# Altium project L298N_Motor_Driver.PrjPcb
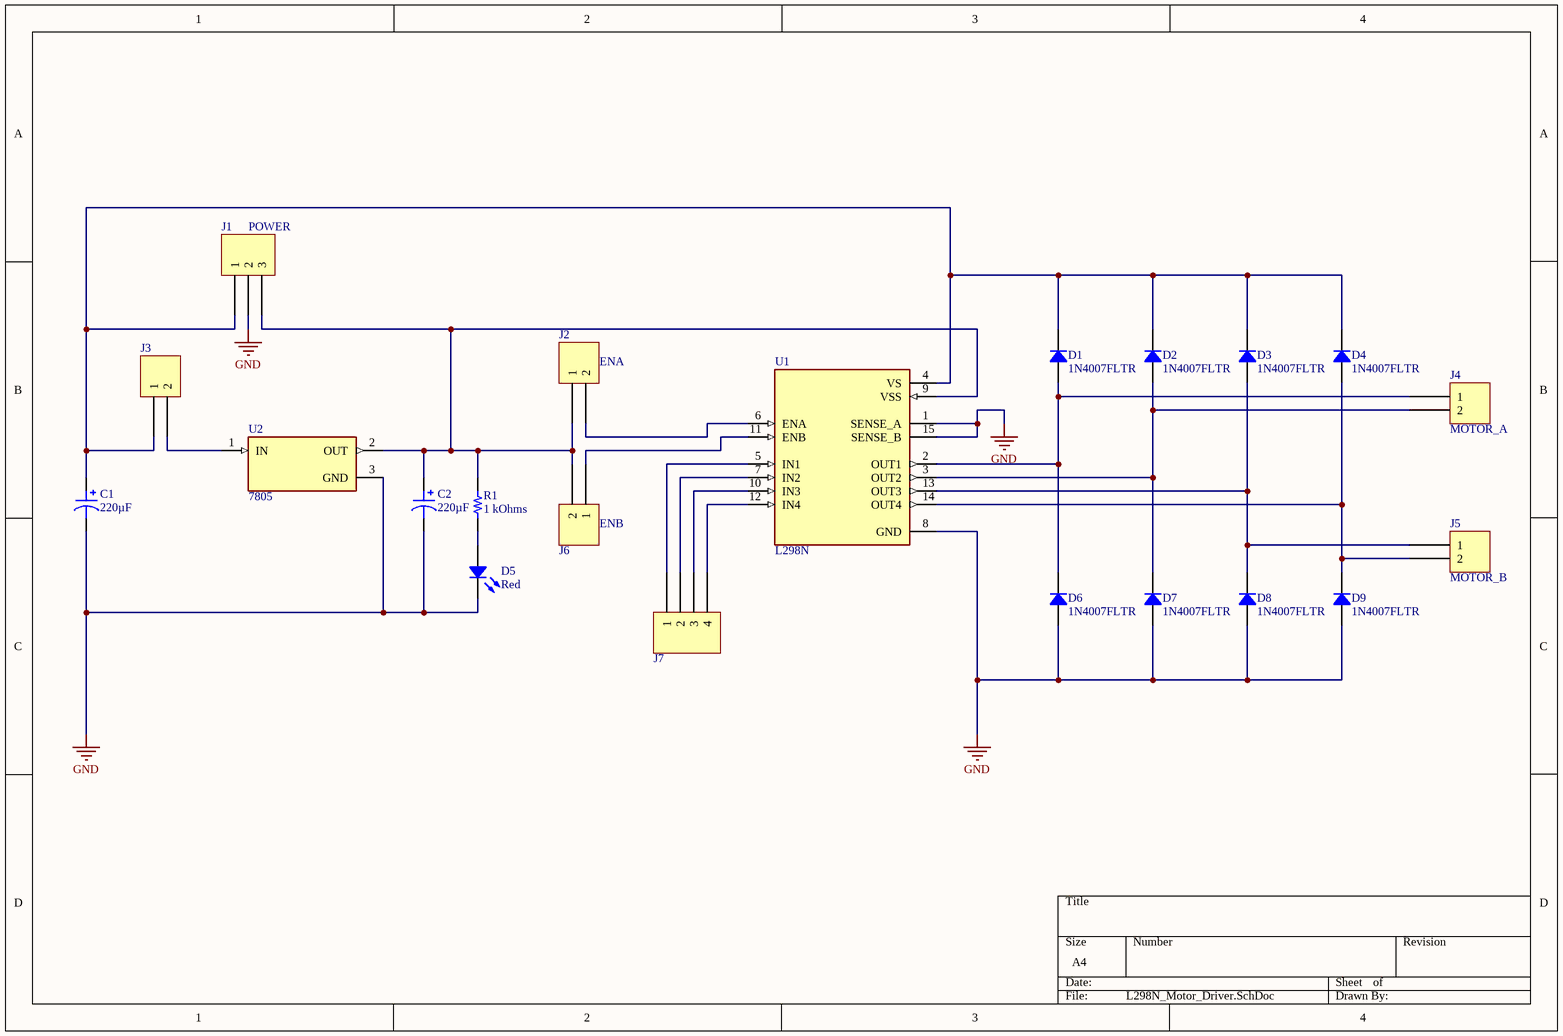
[diagram p0: L298N_Motor_Driver.SchDoc]
1 sheet, 21 parts. Net scope: global (net labels, ports and power ports of the same name join across sheets).
Board file: L298N_Motor_Driver.PcbDoc

## Sheet L298N_Motor_Driver.SchDoc
size A4; SheetNumber: 1; SheetTotal: 1

### Parts
C1  220µF  [CAP ALSMD 8.3MM H10.5MM]
C2  220µF  [CAP ALSMD 8.3MM H10.5MM]
D1  1N4007FLTR  [SOD123F]
D2  1N4007FLTR  [SOD123F]
D3  1N4007FLTR  [SOD123F]
D4  1N4007FLTR  [SOD123F]
D5  Red  [LED 0805_2012 RED]
D6  1N4007FLTR  [SOD123F]
D7  1N4007FLTR  [SOD123F]
D8  1N4007FLTR  [SOD123F]
D9  1N4007FLTR  [SOD123F]
J1  POWER  [TE 282834-3]
J2  ENA  [Header 2 PIN]
J3  Header 2 PIN  [Header 2 PIN]  (value not drawn)
J4  MOTOR_A  [TE 282834-2]
J5  MOTOR_B  [TE 282834-2]
J6  ENB  [Header 2 PIN]
J7  Header 4 PIN  [Header 4 PIN]  (value not drawn)
R1  1 kOhms  [RES 0805_2012]
U1  L298N  [L298N]
U2  7805  [7805CD2T]

### Nets
GND: C1.2 C2.2 D5.2 D6.1 D7.1 D8.1 D9.1 J1.2 U1.1(SENSE_A) U1.8(GND) U1.15(SENSE_B) U2.3(GND)
NetC1_1: C1.1 D1.2 D2.2 D3.2 D4.2 J1.1 J3.1 U1.4(VS)
NetC2_1: C2.1 J1.3 J2.1 J6.2 R1.2 U1.9(VSS) U2.2(OUT)
NetD1_1: D1.1 D6.2 J4.1 U1.2(OUT1)
NetD2_1: D2.1 D7.2 J4.2 U1.3(OUT2)
NetD3_1: D3.1 D8.2 J5.1 U1.13(OUT3)
NetD4_1: D4.1 D9.2 J5.2 U1.14(OUT4)
NetD5_1: D5.1 R1.1
NetJ2_2: J2.2 U1.6(ENA)
NetJ3_2: J3.2 U2.1(IN)
NetJ6_1: J6.1 U1.11(ENB)
NetJ7_1: J7.1 U1.5(IN1)
NetJ7_2: J7.2 U1.7(IN2)
NetJ7_3: J7.3 U1.10(IN3)
NetJ7_4: J7.4 U1.12(IN4)

### Library data of the parts
C1 C2 = UUR1V221MNL6GS: CAP ALUM 220UF 20% 35V SMD; manufacturer: Nichicon; Lifetime @ Temp.: 2000 Hrs @ 85°C; Ripple Current @ High Frequency: 319.8mA @ 10kHz; Ripple Current @ Low Frequency: 246mA @ 120Hz; Surface Mount Land Size: 0.327" L x 0.327" W (8.30mm x 8.30mm); Part Number: UUR1V221MNL6GS; Applications: General Purpose; Capacitance: 220µF; componentlink1description: Datasheet; componentlink1url: http://nichicon-us.com/english/products/pdfs/e-uur.pdf; componentlink2description: DigiKey Link; componentlink2url: http://digikey.com/product-detail/en/nichicon/UUR1V221MNL6GS/493-6238-1-ND/3438751; Device Package: Radial, Can - SMD; Height - Seated (Max): 0.413" (10.50mm); lastupdated: 2.09.2020 01:25:15; Lifecycle Status: Active; Minimum Order: 1; Mounting Type: Surface Mount; Operating Temperature: -40°C ~ 85°C; Package / Case: Radial, Can - SMD; packaging: TapeAndReel; partid: 7568; Part Status: Active; price: 0.20; series: UUR; Size / Dimension: 0.315" Dia (8.00mm); Supplier 1: DigiKey; Supplier Part Number 1: 493-6238-1-ND; Tolerance: ±20%; value: 220µF; Voltage - Rated: 35V
D1-D4 D6-D9 = 1N4007FLTR: STANDARD RECTIFIER 1000V SOD-123; Manufacturer: SMC Diode Solutions; Capacitance @ Vr, F: 15pF @ 4V, 1MHz; Current - Average Rectified (Io): 1A; Current - Reverse Leakage @ Vr: 5µA @ 1000V; Speed: Standard Recovery >500ns, > 200mA (Io); Voltage - Forward (Vf) (Max) @ If: 1.1V @ 1A; Part Number: 1N4007FLTR; ComponentLink1Description: Datasheet; ComponentLink1URL: http://www.smc-diodes.com/propdf/1N4001FL-1N4007FL%20N1646%20REV.A.pdf; ComponentLink2Description: DigiKey Link; ComponentLink2URL: http://digikey.com/product-detail/en/smc-diode-solutions/1N4007FLTR/1655-1N4007FLCT-ND/11657827; Diode Type: Standard; LastUpdated: 30.08.2020 20:59:55; Lifecycle Status: Active; Minimum Order: 1; Mounting Type: Surface Mount; Package / Case: SOD-123F; Packaging: TapeAndReel; PartId: 3314; Price: 0.01; Supplier 1: DigiKey; Supplier Part Number 1: 1655-1N4007FLCT-ND; Supplier Device Package: SOD-123FL; Voltage - DC Reverse (Vr) (Max): 1000V
D5 = XZMDK54W-4: LED RED CLEAR 0805 SMD; Manufacturer: SunLED; Current - Test: 20mA; Lens Color: Colorless; Lens Size: 1.30mm x 1.25mm; Lens Style: Rectangle with Flat Top; Millicandela Rating: 228mcd; Viewing Angle: 140°; Voltage - Forward (Vf) (Typ): 1.95V; Wavelength - Dominant: 630nm; Wavelength - Peak: 645nm; Part Number: XZMDK54W-4; Color: Red; ComponentLink1Description: Datasheet; ComponentLink1URL: https://www.sunledusa.com/products/spec/XZMDK54W-4.pdf; ComponentLink2Description: DigiKey Link; ComponentLink2URL: https://www.digikey.com/en/products/detail/sunled/XZMDK54W-4/13559300; Device Package: 0805 (2012 Metric); Height (Max): 0.50mm; LastUpdated: 3.06.2024 20:00:05; Lens Transparency: Clear; Lifecycle Status: Active; Minimum Order: 1; Mounting Type: Surface Mount; Package / Case: 0805 (2012 Metric); Packaging: TapeAndReel; PartId: 1067; Part Status: Active; Price: 0.05; Series: -; Size / Dimension: 2.00mm L x 1.25mm W; Supplier 1: DigiKey; Supplier Part Number 1: 1497-XZMDK54W-4CT-ND; Supplier Device Package: 0805; Value: Red
J1 = 282834-3: TERM BLK 3P SIDE ENT 2.54MM PCB; Manufacturer: TE Connectivity AMP Connectors; Current: 10A; Mating Orientation: Horizontal with Board; Number of Levels: 1; Pitch: 0.100" (2.54mm); Positions Per Level: 3; Voltage: 150V; Wire Gauge: 16-30 AWG; Wire Termination: Screw - Rising Cage Clamp; Part Number: 282834-3; Color: Green; ComponentLink1Description: Datasheet; ComponentLink1URL: https://www.te.com/commerce/DocumentDelivery/DDEController?Action=srchrtrv&DocNm=282834&DocType=Customer+Drawing&DocLang=English; ComponentLink2Description: DigiKey Link; ComponentLink2URL: http://digikey.com/product-detail/en/te-connectivity-amp-connectors/282834-3/A98334-ND/1153264; LastUpdated: 15.01.2020 04:15:50; Lifecycle Status: Active; Minimum Order: 1; Mounting Type: Through Hole; Packaging: Bulk; Part Status: Active; Price: 2.01; Series: Buchanan; Supplier 1: DigiKey; Supplier Part Number 1: A98334-ND
J2 J6 = Header 2 PIN
J4 J5 = 282834-2: TERM BLK 2P SIDE ENT 2.54MM PCB; Manufacturer: TE Connectivity AMP Connectors; Current: 10A; Mating Orientation: Horizontal with Board; Number of Levels: 1; Pitch: 0.100" (2.54mm); Positions Per Level: 2; Voltage: 150V; Wire Gauge: 16-30 AWG; Wire Termination: Screw - Rising Cage Clamp; Part Number: 282834-2; Color: Green; ComponentLink1Description: Datasheet; ComponentLink1URL: https://www.te.com/commerce/DocumentDelivery/DDEController?Action=srchrtrv&DocNm=282834&DocType=Customer+Drawing&DocLang=English; ComponentLink2Description: DigiKey Link; ComponentLink2URL: http://digikey.com/product-detail/en/te-connectivity-amp-connectors/282834-2/A98333-ND/1150135; LastUpdated: 15.01.2020 04:15:38; Lifecycle Status: Active; Minimum Order: 1; Mounting Type: Through Hole; Packaging: Bulk; Part Status: Active; Price: 0.88; Series: Buchanan; Supplier 1: DigiKey; Supplier Part Number 1: A98333-ND
R1 = Y40821K00000T9W: RES SMD 1K OHM 0.01% 1/5W 0805; Manufacturer: Vishay Foil Resistors (Division of Vishay Precision Group); Power (Watts): 0.2W, 1/5W; Temperature Coefficient: ±2.5ppm/°C; Part Number: Y40821K00000T9W; Value: 1 kOhms; ComponentLink1Description: Datasheet; ComponentLink1URL: http://www.vishaypg.com/docs/63263/FRSG-Series.pdf; ComponentLink2Description: DigiKey Link; ComponentLink2URL: https://www.digikey.com/en/products/detail/vishay-foil-resistors-division-of-vishay-precision-group/Y40821K00000T9W/6561129; Composition: Metal Foil; Device Package: 0805 (2012 Metric); Features: Moisture Resistant, Non-Inductive; Height - Seated (Max): 0.025" (0.64mm); LastUpdated: 8.02.2024 21:02:07; Lifecycle Status: Active; Minimum Order: 1; Number of Terminations: 2; Operating Temperature: -55°C ~ 225°C; Package / Case: 0805 (2012 Metric); Packaging: Tray; PartId: 34938; Part Status: Active; Price: 15.78; Resistance: 1 kOhms; Series: FRSG; Size / Dimension: 0.080" L x 0.050" W (2.03mm x 1.27mm); Supplier 1: DigiKey; Supplier Part Number 1: 804-1156-ND; Supplier Device Package: 0805; Tolerance: ±0.01%
U1 = L298N: Motor Driver
U2 = 7805: Voltage Reg.